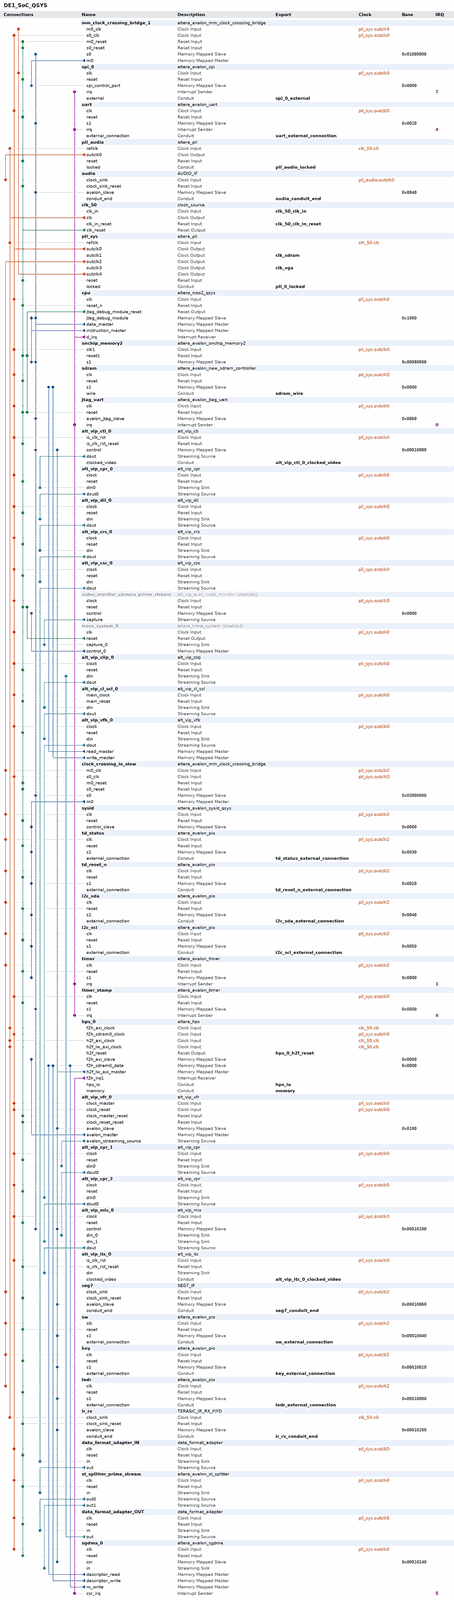
[diagram p0: system contents, whole]
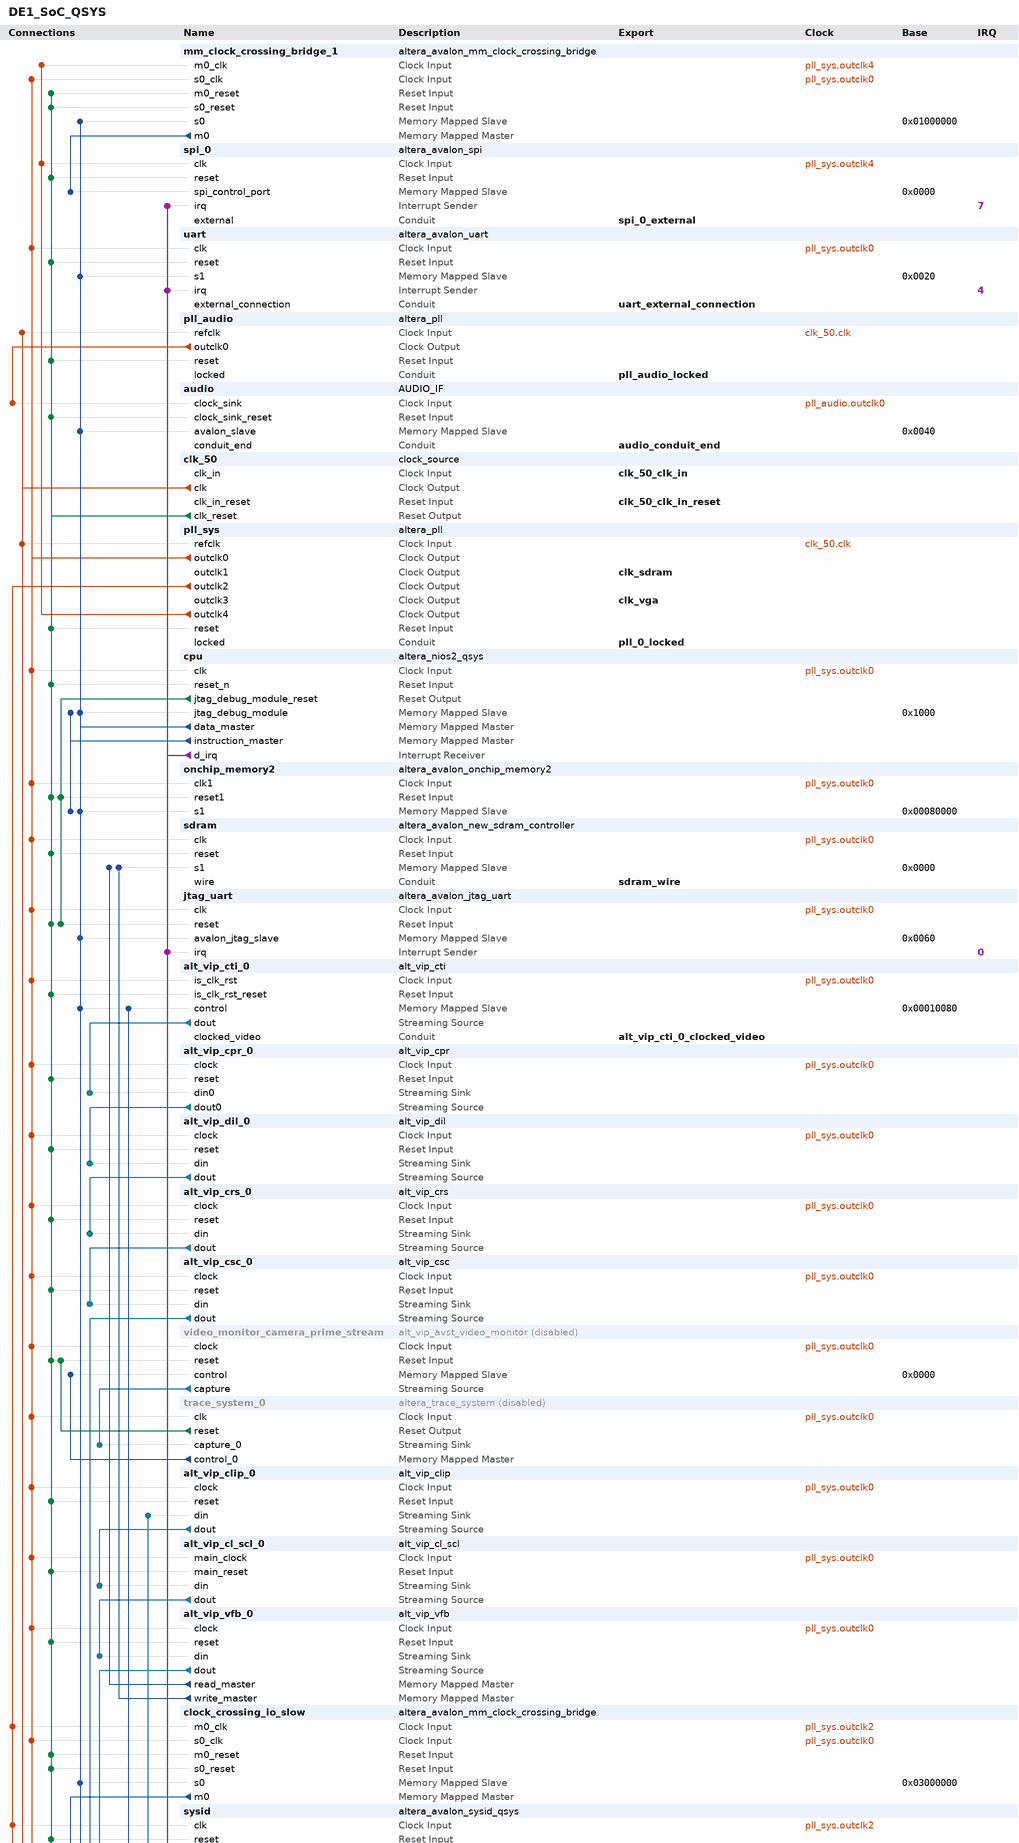
[diagram p1: system contents, upper part]
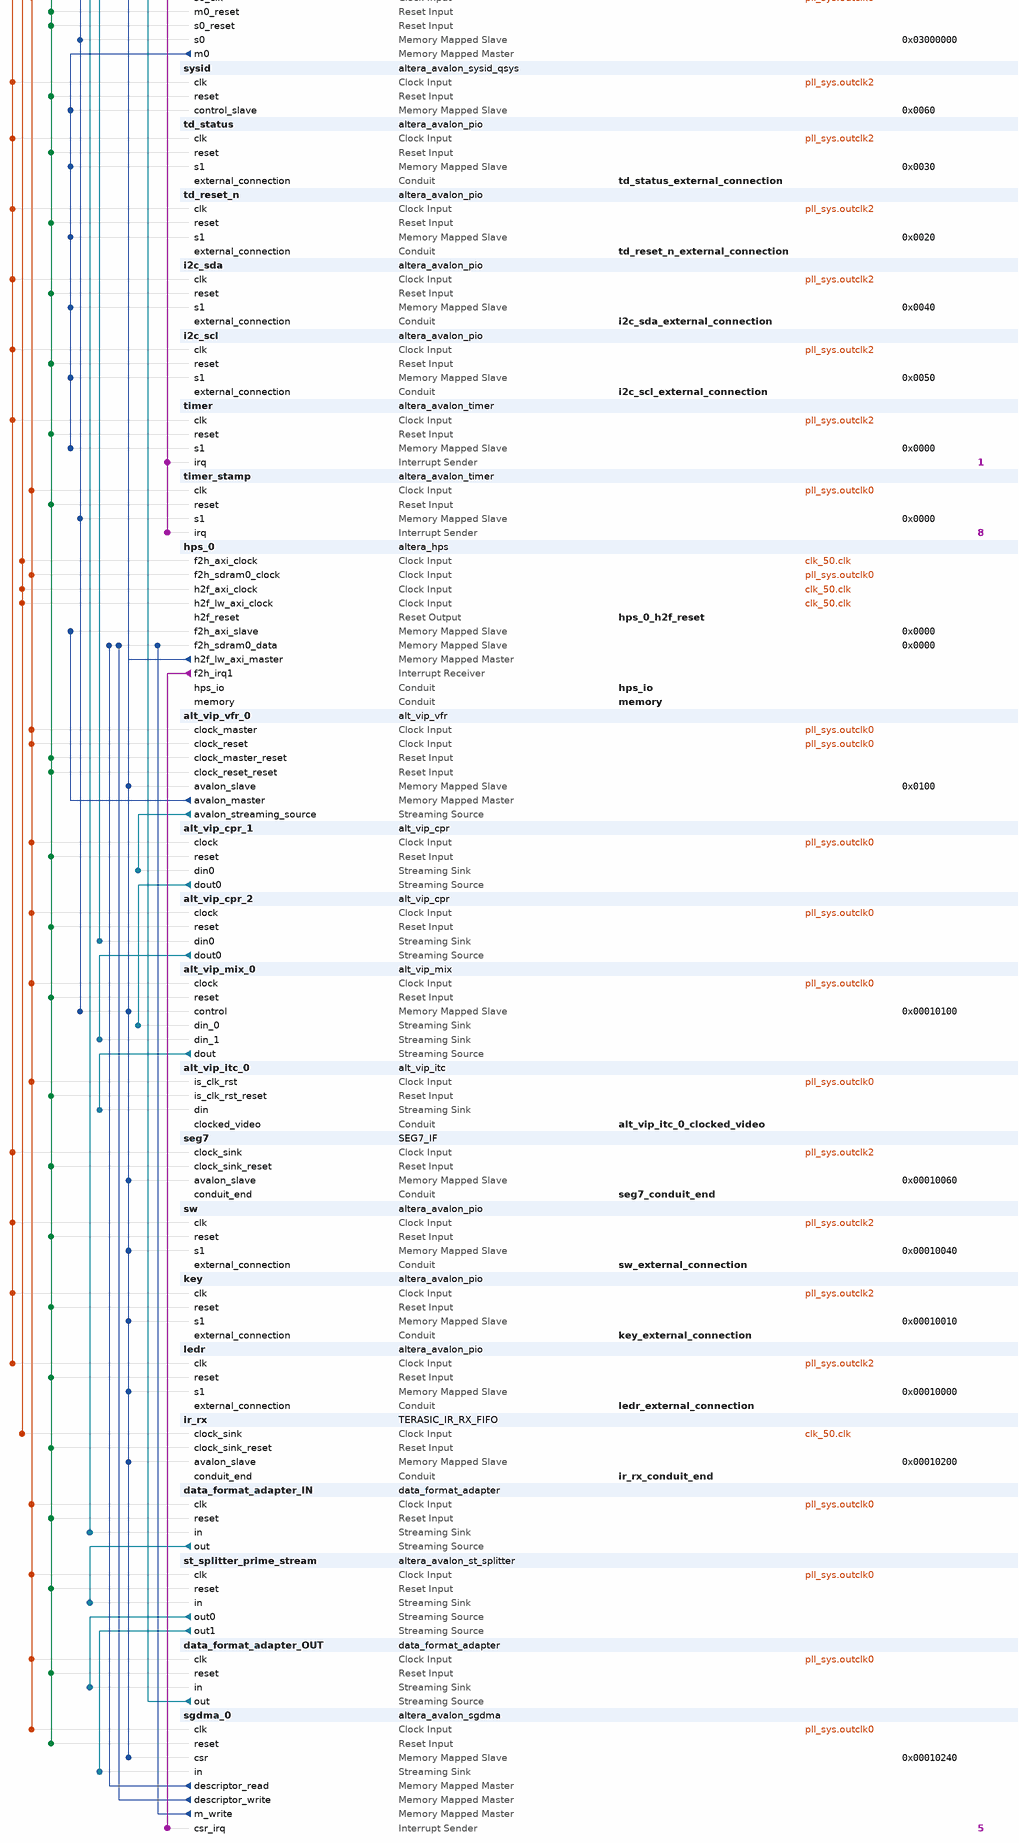
[diagram p2: system contents, lower part]
# Platform Designer (Qsys) system DE1_SoC_QSYS, Cyclone V 5CSEMA5F31C6
# Parameters at their usual value, and those the tool derives, are not listed.
package require -exact qsys 13.1
create_system DE1_SoC_QSYS
set_project_property DEVICE_FAMILY {Cyclone V}
set_project_property DEVICE 5CSEMA5F31C6

add_instance mm_clock_crossing_bridge_1 altera_avalon_mm_clock_crossing_bridge 13.1
set_instance_parameter_value mm_clock_crossing_bridge_1 DATA_WIDTH 32
set_instance_parameter_value mm_clock_crossing_bridge_1 ADDRESS_WIDTH 9
set_instance_parameter_value mm_clock_crossing_bridge_1 MAX_BURST_SIZE 1
set_instance_parameter_value mm_clock_crossing_bridge_1 COMMAND_FIFO_DEPTH 32
set_instance_parameter_value mm_clock_crossing_bridge_1 RESPONSE_FIFO_DEPTH 64
set_instance_parameter_value mm_clock_crossing_bridge_1 MASTER_SYNC_DEPTH 3
set_instance_parameter_value mm_clock_crossing_bridge_1 SLAVE_SYNC_DEPTH 3

add_instance spi_0 altera_avalon_spi 13.1
set_instance_parameter_value spi_0 clockPolarity 1
set_instance_parameter_value spi_0 dataWidth 16
set_instance_parameter_value spi_0 masterSPI true
set_instance_parameter_value spi_0 numberOfSlaves 1
set_instance_parameter_value spi_0 targetClockRate 20000000

add_instance uart altera_avalon_uart 13.1
set_instance_parameter_value uart baud 2400
set_instance_parameter_value uart dataBits 8
set_instance_parameter_value uart fixedBaud false
set_instance_parameter_value uart parity NONE
set_instance_parameter_value uart stopBits 1

add_instance pll_audio altera_pll 13.1
set_instance_parameter_value pll_audio gui_device_speed_grade 2
set_instance_parameter_value pll_audio gui_pll_mode {Fractional-N PLL}
set_instance_parameter_value pll_audio gui_reference_clock_frequency 50.0
set_instance_parameter_value pll_audio gui_operation_mode normal
set_instance_parameter_value pll_audio gui_use_locked true
set_instance_parameter_value pll_audio gui_number_of_clocks 1
set_instance_parameter_value pll_audio gui_output_clock_frequency0 18.432

add_instance audio AUDIO_IF 1.0

add_instance clk_50 clock_source 13.1
set_instance_parameter_value clk_50 clockFrequency 50000000

add_instance pll_sys altera_pll 13.1
set_instance_parameter_value pll_sys gui_device_speed_grade 8
set_instance_parameter_value pll_sys gui_pll_mode {Integer-N PLL}
set_instance_parameter_value pll_sys gui_reference_clock_frequency 50.0
set_instance_parameter_value pll_sys gui_operation_mode normal
set_instance_parameter_value pll_sys gui_use_locked true
set_instance_parameter_value pll_sys gui_number_of_clocks 5
set_instance_parameter_value pll_sys gui_output_clock_frequency0 130.0
set_instance_parameter_value pll_sys gui_output_clock_frequency1 130.0
set_instance_parameter_value pll_sys gui_ps_units1 degrees
set_instance_parameter_value pll_sys gui_phase_shift1 7500
set_instance_parameter_value pll_sys gui_phase_shift_deg1 -90.0
set_instance_parameter_value pll_sys gui_output_clock_frequency2 10.0
set_instance_parameter_value pll_sys gui_output_clock_frequency3 65.0

add_instance cpu altera_nios2_qsys 13.1
set_instance_parameter_value cpu manuallyAssignCpuID false
set_instance_parameter_value cpu resetSlave onchip_memory2.s1
set_instance_parameter_value cpu exceptionSlave onchip_memory2.s1
set_instance_parameter_value cpu breakSlave cpu.jtag_debug_module
set_instance_parameter_value cpu impl Fast
set_instance_parameter_value cpu icache_size 4096

add_instance onchip_memory2 altera_avalon_onchip_memory2 13.1
set_instance_parameter_value onchip_memory2 dataWidth 32
set_instance_parameter_value onchip_memory2 dualPort false
set_instance_parameter_value onchip_memory2 initMemContent true
set_instance_parameter_value onchip_memory2 initializationFileName onchip_memory2
set_instance_parameter_value onchip_memory2 memorySize 160000

add_instance sdram altera_avalon_new_sdram_controller 13.1
set_instance_parameter_value sdram TAC 5.5
set_instance_parameter_value sdram TRCD 20.0
set_instance_parameter_value sdram TRP 20.0
set_instance_parameter_value sdram casLatency 3
set_instance_parameter_value sdram columnWidth 10
set_instance_parameter_value sdram dataWidth 16
set_instance_parameter_value sdram generateSimulationModel true
set_instance_parameter_value sdram model custom
set_instance_parameter_value sdram numberOfBanks 4
set_instance_parameter_value sdram numberOfChipSelects 1
set_instance_parameter_value sdram powerUpDelay 100.0
set_instance_parameter_value sdram refreshPeriod 15.625
set_instance_parameter_value sdram rowWidth 13

add_instance jtag_uart altera_avalon_jtag_uart 13.1
set_instance_parameter_value jtag_uart simInteractiveOptions INTERACTIVE_ASCII_OUTPUT

add_instance alt_vip_cti_0 alt_vip_cti 13.1
set_instance_parameter_value alt_vip_cti_0 FAMILY {Cyclone V}
set_instance_parameter_value alt_vip_cti_0 BPS 8
set_instance_parameter_value alt_vip_cti_0 NUMBER_OF_COLOUR_PLANES 2
set_instance_parameter_value alt_vip_cti_0 COLOUR_PLANES_ARE_IN_PARALLEL 0
set_instance_parameter_value alt_vip_cti_0 SYNC_TO 0
set_instance_parameter_value alt_vip_cti_0 USE_EMBEDDED_SYNCS 1
set_instance_parameter_value alt_vip_cti_0 ADD_DATA_ENABLE_SIGNAL 0
set_instance_parameter_value alt_vip_cti_0 ACCEPT_COLOURS_IN_SEQ 0
set_instance_parameter_value alt_vip_cti_0 USE_STD 0
set_instance_parameter_value alt_vip_cti_0 STD_WIDTH 1
set_instance_parameter_value alt_vip_cti_0 GENERATE_ANC 0
set_instance_parameter_value alt_vip_cti_0 INTERLACED 1
set_instance_parameter_value alt_vip_cti_0 H_ACTIVE_PIXELS_F0 720
set_instance_parameter_value alt_vip_cti_0 V_ACTIVE_LINES_F0 288
set_instance_parameter_value alt_vip_cti_0 V_ACTIVE_LINES_F1 288
set_instance_parameter_value alt_vip_cti_0 FIFO_DEPTH 1440
set_instance_parameter_value alt_vip_cti_0 CLOCKS_ARE_SAME 0
set_instance_parameter_value alt_vip_cti_0 USE_CONTROL 1
set_instance_parameter_value alt_vip_cti_0 GENERATE_SYNC 0

add_instance alt_vip_cpr_0 alt_vip_cpr 13.1
set_instance_parameter_value alt_vip_cpr_0 DIN1_ENABLED 0
set_instance_parameter_value alt_vip_cpr_0 DOUT1_SYMBOLS_PER_BEAT 0
set_instance_parameter_value alt_vip_cpr_0 DOUT0_SYMBOLS_PER_BEAT 2
set_instance_parameter_value alt_vip_cpr_0 DOUT1_ENABLED 0
set_instance_parameter_value alt_vip_cpr_0 PARAMETERISATION {<colourPatternRearrangerParams><CPR_NAME>Color Plane Sequencer</CPR_NAME><CPR_BPS>8</CPR_BPS><CPR_PORTS><INPUT_PORT><NAME>din0</NAME><STREAMING_DESCRIPTOR>[C,Y]</STREAMING_DESCRIPTOR><ENABLED>true</ENABLED></INPUT_PORT><INPUT_PORT><NAME>din1</NAME><STREAMING_DESCRIPTOR>[Channel]</STREAMING_DESCRIPTOR><ENABLED>false</ENABLED></INPUT_PORT><OUTPUT_PORT><NAME>dout0</NAME><STREAMING_DESCRIPTOR>[C:Y]</STREAMING_DESCRIPTOR><ENABLED>true</ENABLED><NON_IMAGE_PACKET_SOURCE>din0</NON_IMAGE_PACKET_SOURCE><HALVE_WIDTH>false</HALVE_WIDTH></OUTPUT_PORT><OUTPUT_PORT><NAME>dout1</NAME><STREAMING_DESCRIPTOR>[Channel]</STREAMING_DESCRIPTOR><ENABLED>false</ENABLED><NON_IMAGE_PACKET_SOURCE>din0</NON_IMAGE_PACKET_SOURCE><HALVE_WIDTH>false</HALVE_WIDTH></OUTPUT_PORT></CPR_PORTS><CPR_INPUT_2_PIXELS>false</CPR_INPUT_2_PIXELS></colourPatternRearrangerParams>}
set_instance_parameter_value alt_vip_cpr_0 DIN0_SYMBOLS_PER_BEAT 1
set_instance_parameter_value alt_vip_cpr_0 DIN1_SYMBOLS_PER_BEAT 0

add_instance alt_vip_dil_0 alt_vip_dil 13.1
set_instance_parameter_value alt_vip_dil_0 READ_MASTERS_REQUIRED 0
set_instance_parameter_value alt_vip_dil_0 WRITE_MASTERS_REQUIRED 0
set_instance_parameter_value alt_vip_dil_0 PARAMETERISATION {<deinterlacerParams><DIL_NAME>my_deinterlacing_core</DIL_NAME><DIL_MAX_WIDTH>720</DIL_MAX_WIDTH><DIL_MAX_HEIGHT>576</DIL_MAX_HEIGHT><DIL_CHANNELS_IN_SEQ>1</DIL_CHANNELS_IN_SEQ><DIL_CHANNELS_IN_PAR>2</DIL_CHANNELS_IN_PAR><DIL_BPS>8</DIL_BPS><DIL_METHOD>DEINTERLACING_BOB_SCANLINE_INTERPOLATION</DIL_METHOD><DIL_FRAMEBUFFERS_ADDR>00</DIL_FRAMEBUFFERS_ADDR><DIL_PRODUCE_FIELDS>DEINTERLACING_F0</DIL_PRODUCE_FIELDS><DIL_BUFFER_AS_THOUGH>DEINTERLACING_NO_BUFFERING</DIL_BUFFER_AS_THOUGH><DIL_DEFAULT_INITIAL_FIELD>FIELD_F0_FIRST</DIL_DEFAULT_INITIAL_FIELD><DIL_MASTER_PORT_WIDTH>64</DIL_MASTER_PORT_WIDTH><DIL_MEM_MASTERS_USE_SEPARATE_CLOCK>0</DIL_MEM_MASTERS_USE_SEPARATE_CLOCK><DIL_EDGE_DEPENDENT_INTERPOLATION>1</DIL_EDGE_DEPENDENT_INTERPOLATION><DIL_MOTION_BLEED>0</DIL_MOTION_BLEED><DIL_RDATA_FIFO_DEPTH>64</DIL_RDATA_FIFO_DEPTH><DIL_RDATA_BURST_TARGET>32</DIL_RDATA_BURST_TARGET><DIL_WDATA_FIFO_DEPTH>64</DIL_WDATA_FIFO_DEPTH><DIL_WDATA_BURST_TARGET>32</DIL_WDATA_BURST_TARGET><DIL_MAX_NUMBER_PACKETS>1</DIL_MAX_NUMBER_PACKETS><DIL_MAX_SYMBOLS_IN_PACKET>10</DIL_MAX_SYMBOLS_IN_PACKET><DIL_MA_RUNTIME_CTRL>0</DIL_MA_RUNTIME_CTRL><DIL_PROPAGATE_PROGRESSIVE>false</DIL_PROPAGATE_PROGRESSIVE><DIL_CONTROLLED_DROP_REPEAT>0</DIL_CONTROLLED_DROP_REPEAT><DIL_MA_422>0</DIL_MA_422><DIL_BURST_ALIGNMENT>0</DIL_BURST_ALIGNMENT></deinterlacerParams>}
set_instance_parameter_value alt_vip_dil_0 MOTION_MASTERS_REQUIRED 0

add_instance alt_vip_crs_0 alt_vip_crs 13.1
set_instance_parameter_value alt_vip_crs_0 OUT_CHANNELS_IN_PAR 3
set_instance_parameter_value alt_vip_crs_0 IN_CHANNELS_IN_PAR 2
set_instance_parameter_value alt_vip_crs_0 PARAMETERISATION {<chromaResamplerParams><CRS_NAME>chroma_resampler</CRS_NAME><CRS_BPS>8</CRS_BPS><CRS_WIDTH>720</CRS_WIDTH><CRS_HEIGHT>576</CRS_HEIGHT><CRS_PARALLEL_MODE>true</CRS_PARALLEL_MODE><CRS_RESAMPLING><FORMAT><IN>422</IN><OUT>444</OUT></FORMAT><COSITING><V>true</V><H>true</H></COSITING></CRS_RESAMPLING><CRS_ALGORITHM><V><NAME>INTERPOLATION_1D_NEAREST_NEIGHBOUR</NAME><LUMA_ADAPTIVE>false</LUMA_ADAPTIVE></V><H><NAME>INTERPOLATION_1D_FULL_FILTERING</NAME><LUMA_ADAPTIVE>false</LUMA_ADAPTIVE></H></CRS_ALGORITHM></chromaResamplerParams>}

add_instance alt_vip_csc_0 alt_vip_csc 13.1
set_instance_parameter_value alt_vip_csc_0 PARAMETERISATION {<cscParams> <CSC_NAME>a_csc</CSC_NAME> <CSC_CHANNELS_IN_SEQ>1</CSC_CHANNELS_IN_SEQ>  <CSC_CHANNELS_IN_PAR>3</CSC_CHANNELS_IN_PAR>  <CSC_INPUT_OUTPUT_DATATYPES>   <IODT_INPUT_BPS>8</IODT_INPUT_BPS>   <IODT_OUTPUT_BPS>8</IODT_OUTPUT_BPS>   <IODT_INPUT_DATA_TYPE>DATA_TYPE_UNSIGNED</IODT_INPUT_DATA_TYPE>   <IODT_OUTPUT_DATA_TYPE>DATA_TYPE_UNSIGNED</IODT_OUTPUT_DATA_TYPE>   <IODT_USE_INPUT_GUARD_BANDS>true</IODT_USE_INPUT_GUARD_BANDS>   <IODT_INPUT_GUARD_MIN>16</IODT_INPUT_GUARD_MIN>   <IODT_INPUT_GUARD_MAX>240</IODT_INPUT_GUARD_MAX>   <IODT_USE_OUTPUT_GUARD_BANDS>false</IODT_USE_OUTPUT_GUARD_BANDS>   <IODT_OUTPUT_GUARD_MIN>0</IODT_OUTPUT_GUARD_MIN>   <IODT_OUTPUT_GUARD_MAX>255</IODT_OUTPUT_GUARD_MAX>  </CSC_INPUT_OUTPUT_DATATYPES>  <CSC_PREDEFINED_CONVERSION>SDTV_YCBCR_TO_CRGB</CSC_PREDEFINED_CONVERSION>  <CSC_COEFFICIENTS><row><mult>2.018</mult><mult>0.0</mult><mult>1.164</mult><add>-276.928</add></row><row><mult>-0.391</mult><mult>-0.813</mult><mult>1.164</mult><add>135.488</add></row><row><mult>0.0</mult><mult>1.596</mult><mult>1.164</mult><add>-222.912</add></row></CSC_COEFFICIENTS>  <CSC_COEFF_PRECISION>   <CPC_INTEGER_BITS>2</CPC_INTEGER_BITS>   <CPC_FRACTION_BITS>8</CPC_FRACTION_BITS>   <CPC_COEFFS_SIGNED>true</CPC_COEFFS_SIGNED>  </CSC_COEFF_PRECISION>  <CSC_SUMM_PRECISION>   <CPC_INTEGER_BITS>9</CPC_INTEGER_BITS>   <CPC_FRACTION_BITS>8</CPC_FRACTION_BITS>   <CPC_COEFFS_SIGNED>true</CPC_COEFFS_SIGNED>  </CSC_SUMM_PRECISION>  <CSC_OUTPUT_CONVERSION>   <ODTC_SCALE>0</ODTC_SCALE>   <ODTC_FIXEDPOINT_TO_INTEGER>FRACTION_BITS_ROUND_HALF_UP</ODTC_FIXEDPOINT_TO_INTEGER>   <ODTC_CONVERT_SIGNED_TO_UNSIGNED>CONVERT_TO_UNSIGNED_SATURATE</ODTC_CONVERT_SIGNED_TO_UNSIGNED>  </CSC_OUTPUT_CONVERSION> <CSC_RUNTIME_COEFFICIENTS>false</CSC_RUNTIME_COEFFICIENTS> </cscParams>}

add_instance video_monitor_camera_prime_stream alt_vip_avst_video_monitor 13.1
set_instance_property video_monitor_camera_prime_stream ENABLED false
set_instance_parameter_value video_monitor_camera_prime_stream BPS 8
set_instance_parameter_value video_monitor_camera_prime_stream CHANNELS_IN_PAR 3
set_instance_parameter_value video_monitor_camera_prime_stream CHANNELS_IN_SEQ 1
set_instance_parameter_value video_monitor_camera_prime_stream BUFFER_DEPTH 256
set_instance_parameter_value video_monitor_camera_prime_stream THUMBNAIL_SUPPORT 1
set_instance_parameter_value video_monitor_camera_prime_stream CAPTURE_SYM_WIDTH 32

add_instance trace_system_0 altera_trace_system 13.1
set_instance_property trace_system_0 ENABLED false
set_instance_parameter_value trace_system_0 MANUAL_DEBUG_FABRIC 1
set_instance_parameter_value trace_system_0 HOST_TYPE JTAG
set_instance_parameter_value trace_system_0 CAPTURE_WIDTH 32
set_instance_parameter_value trace_system_0 INPUTS 2
set_instance_parameter_value trace_system_0 INTERNAL_MEM 1
set_instance_parameter_value trace_system_0 MEMSIZE 32768
set_instance_parameter_value trace_system_0 EXTMEM_BASE 0
set_instance_parameter_value trace_system_0 EXTMEM_SIZE 1048576
set_instance_parameter_value trace_system_0 ENABLE_BETA_EXTERNAL_MEM false
set_instance_parameter_value trace_system_0 CLOCK_RATE 130000000
set_instance_parameter_value trace_system_0 PIPELINE_STAGE_ON_ALL_INPUTS true

add_instance alt_vip_clip_0 alt_vip_clip 13.1
set_instance_parameter_value alt_vip_clip_0 PARAMETERISATION {<clipperParams><CLIP_NAME>clipper</CLIP_NAME><CLIP_BPS>8</CLIP_BPS><CLIP_CHANNELS_IN_SEQ>1</CLIP_CHANNELS_IN_SEQ><CLIP_CHANNELS_IN_PAR>3</CLIP_CHANNELS_IN_PAR><CLIP_WIDTH>720</CLIP_WIDTH><CLIP_HEIGHT>576</CLIP_HEIGHT><CLIP_RUNTIME_CONTROL>false</CLIP_RUNTIME_CONTROL><CLIP_OFFSETS_NOT_RECTANGLE>false</CLIP_OFFSETS_NOT_RECTANGLE><CLIP_LEFT_OFFSET>40</CLIP_LEFT_OFFSET><CLIP_RIGHT_OFFSET>640</CLIP_RIGHT_OFFSET><CLIP_TOP_OFFSET>24</CLIP_TOP_OFFSET><CLIP_BOTTOM_OFFSET>480</CLIP_BOTTOM_OFFSET></clipperParams>}

add_instance alt_vip_cl_scl_0 alt_vip_cl_scl 13.1
set_instance_parameter_value alt_vip_cl_scl_0 FAMILY {Cyclone V}
set_instance_parameter_value alt_vip_cl_scl_0 SYMBOLS_IN_SEQ 1
set_instance_parameter_value alt_vip_cl_scl_0 SYMBOLS_IN_PAR 3
set_instance_parameter_value alt_vip_cl_scl_0 BITS_PER_SYMBOL 8
set_instance_parameter_value alt_vip_cl_scl_0 EXTRA_PIPELINING 0
set_instance_parameter_value alt_vip_cl_scl_0 IS_422 0
set_instance_parameter_value alt_vip_cl_scl_0 NO_BLANKING 1
set_instance_parameter_value alt_vip_cl_scl_0 MAX_IN_WIDTH 640
set_instance_parameter_value alt_vip_cl_scl_0 MAX_IN_HEIGHT 480
set_instance_parameter_value alt_vip_cl_scl_0 MAX_OUT_WIDTH 270
set_instance_parameter_value alt_vip_cl_scl_0 MAX_OUT_HEIGHT 200
set_instance_parameter_value alt_vip_cl_scl_0 RUNTIME_CONTROL 0
set_instance_parameter_value alt_vip_cl_scl_0 ALWAYS_DOWNSCALE 1
set_instance_parameter_value alt_vip_cl_scl_0 ALGORITHM_NAME POLYPHASE
set_instance_parameter_value alt_vip_cl_scl_0 DEFAULT_EDGE_THRESH 7
set_instance_parameter_value alt_vip_cl_scl_0 DEFAULT_UPPER_BLUR 15
set_instance_parameter_value alt_vip_cl_scl_0 DEFAULT_LOWER_BLUR 0
set_instance_parameter_value alt_vip_cl_scl_0 ENABLE_FIR 0
set_instance_parameter_value alt_vip_cl_scl_0 ARE_IDENTICAL 1
set_instance_parameter_value alt_vip_cl_scl_0 V_TAPS 8
set_instance_parameter_value alt_vip_cl_scl_0 V_PHASES 16
set_instance_parameter_value alt_vip_cl_scl_0 H_TAPS 8
set_instance_parameter_value alt_vip_cl_scl_0 H_PHASES 16
set_instance_parameter_value alt_vip_cl_scl_0 V_SIGNED 1
set_instance_parameter_value alt_vip_cl_scl_0 V_INTEGER_BITS 1
set_instance_parameter_value alt_vip_cl_scl_0 V_FRACTION_BITS 7
set_instance_parameter_value alt_vip_cl_scl_0 H_SIGNED 1
set_instance_parameter_value alt_vip_cl_scl_0 H_INTEGER_BITS 1
set_instance_parameter_value alt_vip_cl_scl_0 H_FRACTION_BITS 7
set_instance_parameter_value alt_vip_cl_scl_0 PRESERVE_BITS 0
set_instance_parameter_value alt_vip_cl_scl_0 LOAD_AT_RUNTIME 0
set_instance_parameter_value alt_vip_cl_scl_0 V_BANKS 1
set_instance_parameter_value alt_vip_cl_scl_0 V_SYMMETRIC 0
set_instance_parameter_value alt_vip_cl_scl_0 V_FUNCTION LANCZOS_2
set_instance_parameter_value alt_vip_cl_scl_0 V_COEFF_FILE {<enter file name (including full path)>}
set_instance_parameter_value alt_vip_cl_scl_0 H_BANKS 1
set_instance_parameter_value alt_vip_cl_scl_0 H_SYMMETRIC 0
set_instance_parameter_value alt_vip_cl_scl_0 H_FUNCTION LANCZOS_2
set_instance_parameter_value alt_vip_cl_scl_0 H_COEFF_FILE {<enter file name (including full path)>}
set_instance_parameter_value alt_vip_cl_scl_0 IS_420 0

add_instance alt_vip_vfb_0 alt_vip_vfb 13.1

add_instance clock_crossing_io_slow altera_avalon_mm_clock_crossing_bridge 13.1
set_instance_parameter_value clock_crossing_io_slow DATA_WIDTH 32
set_instance_parameter_value clock_crossing_io_slow ADDRESS_WIDTH 9
set_instance_parameter_value clock_crossing_io_slow MAX_BURST_SIZE 1
set_instance_parameter_value clock_crossing_io_slow COMMAND_FIFO_DEPTH 32
set_instance_parameter_value clock_crossing_io_slow RESPONSE_FIFO_DEPTH 256
set_instance_parameter_value clock_crossing_io_slow MASTER_SYNC_DEPTH 3
set_instance_parameter_value clock_crossing_io_slow SLAVE_SYNC_DEPTH 3

add_instance sysid altera_avalon_sysid_qsys 13.1
set_instance_parameter_value sysid id 0

add_instance td_status altera_avalon_pio 13.1
set_instance_parameter_value td_status direction Input
set_instance_parameter_value td_status width 2

add_instance td_reset_n altera_avalon_pio 13.1
set_instance_parameter_value td_reset_n direction Output
set_instance_parameter_value td_reset_n width 1

add_instance i2c_sda altera_avalon_pio 13.1
set_instance_parameter_value i2c_sda direction Bidir
set_instance_parameter_value i2c_sda width 1

add_instance i2c_scl altera_avalon_pio 13.1
set_instance_parameter_value i2c_scl direction Output
set_instance_parameter_value i2c_scl width 1

add_instance timer altera_avalon_timer 13.1
set_instance_parameter_value timer period 1
set_instance_parameter_value timer periodUnits MSEC

add_instance timer_stamp altera_avalon_timer 13.1
set_instance_parameter_value timer_stamp period 1
set_instance_parameter_value timer_stamp periodUnits MSEC

add_instance hps_0 altera_hps 13.1
set_instance_parameter_value hps_0 MEM_VENDOR JEDEC
set_instance_parameter_value hps_0 MEM_ROW_ADDR_WIDTH 15
set_instance_parameter_value hps_0 MEM_COL_ADDR_WIDTH 10
set_instance_parameter_value hps_0 MEM_DQ_WIDTH 32
set_instance_parameter_value hps_0 MEM_BANKADDR_WIDTH 3
set_instance_parameter_value hps_0 MEM_DRV_STR RZQ/7
set_instance_parameter_value hps_0 MEM_RTT_NOM RZQ/4
set_instance_parameter_value hps_0 MEM_RTT_WR RZQ/4
set_instance_parameter_value hps_0 MEM_WTCL 8
set_instance_parameter_value hps_0 MEM_TCL 11
set_instance_parameter_value hps_0 TIMING_TIS 180
set_instance_parameter_value hps_0 TIMING_TIH 140
set_instance_parameter_value hps_0 TIMING_TDS 30
set_instance_parameter_value hps_0 TIMING_TDH 65
set_instance_parameter_value hps_0 TIMING_TDQSQ 125
set_instance_parameter_value hps_0 TIMING_TDQSCK 255
set_instance_parameter_value hps_0 TIMING_TQSH 0.4
set_instance_parameter_value hps_0 MEM_TRAS_NS 35.0
set_instance_parameter_value hps_0 MEM_TRCD_NS 13.75
set_instance_parameter_value hps_0 MEM_TRP_NS 13.75
set_instance_parameter_value hps_0 MEM_TRFC_NS 260.0
set_instance_parameter_value hps_0 MEM_TFAW_NS 30.0
set_instance_parameter_value hps_0 REF_CLK_FREQ 25.0
set_instance_parameter_value hps_0 DEFAULT_FAST_SIM_MODEL true
set_instance_parameter_value hps_0 TIMING_BOARD_MAX_CK_DELAY 0.03
set_instance_parameter_value hps_0 TIMING_BOARD_MAX_DQS_DELAY 0.02
set_instance_parameter_value hps_0 TIMING_BOARD_SKEW_CKDQS_DIMM_MIN 0.09
set_instance_parameter_value hps_0 TIMING_BOARD_SKEW_CKDQS_DIMM_MAX 0.16
set_instance_parameter_value hps_0 TIMING_BOARD_SKEW_WITHIN_DQS 0.01
set_instance_parameter_value hps_0 TIMING_BOARD_SKEW_BETWEEN_DQS 0.08
set_instance_parameter_value hps_0 TIMING_BOARD_DQ_TO_DQS_SKEW 0.0
set_instance_parameter_value hps_0 TIMING_BOARD_AC_SKEW 0.03
set_instance_parameter_value hps_0 TIMING_BOARD_AC_TO_CK_SKEW 0.0
set_instance_parameter_value hps_0 MEM_CLK_FREQ 400.0
set_instance_parameter_value hps_0 HPS_PROTOCOL DDR3
set_instance_parameter_value hps_0 STM_Enable false
set_instance_parameter_value hps_0 F2S_Width 2
set_instance_parameter_value hps_0 S2F_Width 2
set_instance_parameter_value hps_0 LWH2F_Enable true
set_instance_parameter_value hps_0 F2SDRAM_Type {Avalon-MM Bidirectional}
set_instance_parameter_value hps_0 F2SDRAM_Width 64
set_instance_parameter_value hps_0 F2SCLK_DBGRST_Enable false
set_instance_parameter_value hps_0 F2SCLK_WARMRST_Enable false
set_instance_parameter_value hps_0 F2SCLK_COLDRST_Enable false
set_instance_parameter_value hps_0 F2SINTERRUPT_Enable true
set_instance_parameter_value hps_0 EMAC1_PinMuxing {HPS I/O Set 0}
set_instance_parameter_value hps_0 EMAC1_Mode RGMII
set_instance_parameter_value hps_0 QSPI_PinMuxing {HPS I/O Set 0}
set_instance_parameter_value hps_0 QSPI_Mode {1 SS}
set_instance_parameter_value hps_0 SDIO_PinMuxing {HPS I/O Set 0}
set_instance_parameter_value hps_0 SDIO_Mode {4-bit Data}
set_instance_parameter_value hps_0 USB1_PinMuxing {HPS I/O Set 0}
set_instance_parameter_value hps_0 USB1_Mode SDR
set_instance_parameter_value hps_0 SPIM1_PinMuxing {HPS I/O Set 0}
set_instance_parameter_value hps_0 SPIM1_Mode {Single Slave Select}
set_instance_parameter_value hps_0 UART0_PinMuxing {HPS I/O Set 0}
set_instance_parameter_value hps_0 UART0_Mode {No Flow Control}
set_instance_parameter_value hps_0 I2C0_PinMuxing {HPS I/O Set 0}
set_instance_parameter_value hps_0 I2C0_Mode I2C
set_instance_parameter_value hps_0 I2C1_PinMuxing {HPS I/O Set 0}
set_instance_parameter_value hps_0 I2C1_Mode I2C
set_instance_parameter_value hps_0 S2FCLK_USER1CLK_FREQ 100
set_instance_parameter_value hps_0 FPGA_PERIPHERAL_OUTPUT_CLOCK_FREQ_EMAC0_MD_CLK 100
set_instance_parameter_value hps_0 FPGA_PERIPHERAL_OUTPUT_CLOCK_FREQ_EMAC0_GTX_CLK 100
set_instance_parameter_value hps_0 FPGA_PERIPHERAL_OUTPUT_CLOCK_FREQ_EMAC1_MD_CLK 100
set_instance_parameter_value hps_0 FPGA_PERIPHERAL_OUTPUT_CLOCK_FREQ_EMAC1_GTX_CLK 100

add_instance alt_vip_vfr_0 alt_vip_vfr 13.1
set_instance_parameter_value alt_vip_vfr_0 MAX_IMAGE_WIDTH 1024

add_instance alt_vip_cpr_1 alt_vip_cpr 13.1
set_instance_parameter_value alt_vip_cpr_1 DIN1_ENABLED 0
set_instance_parameter_value alt_vip_cpr_1 DOUT1_SYMBOLS_PER_BEAT 0
set_instance_parameter_value alt_vip_cpr_1 DOUT0_SYMBOLS_PER_BEAT 3
set_instance_parameter_value alt_vip_cpr_1 DOUT1_ENABLED 0
set_instance_parameter_value alt_vip_cpr_1 PARAMETERISATION {<colourPatternRearrangerParams><CPR_NAME>Color Plane Sequencer</CPR_NAME><CPR_BPS>8</CPR_BPS><CPR_PORTS><INPUT_PORT><NAME>din0</NAME><STREAMING_DESCRIPTOR>[B:G:R:unnamed]</STREAMING_DESCRIPTOR><ENABLED>true</ENABLED></INPUT_PORT><INPUT_PORT><NAME>din1</NAME><STREAMING_DESCRIPTOR>[Channel]</STREAMING_DESCRIPTOR><ENABLED>false</ENABLED></INPUT_PORT><OUTPUT_PORT><NAME>dout0</NAME><STREAMING_DESCRIPTOR>[B:G:R]</STREAMING_DESCRIPTOR><ENABLED>true</ENABLED><NON_IMAGE_PACKET_SOURCE>din0</NON_IMAGE_PACKET_SOURCE><HALVE_WIDTH>false</HALVE_WIDTH></OUTPUT_PORT><OUTPUT_PORT><NAME>dout1</NAME><STREAMING_DESCRIPTOR>[Channel]</STREAMING_DESCRIPTOR><ENABLED>false</ENABLED><NON_IMAGE_PACKET_SOURCE>din0</NON_IMAGE_PACKET_SOURCE><HALVE_WIDTH>false</HALVE_WIDTH></OUTPUT_PORT></CPR_PORTS><CPR_INPUT_2_PIXELS>false</CPR_INPUT_2_PIXELS></colourPatternRearrangerParams>}
set_instance_parameter_value alt_vip_cpr_1 DIN0_SYMBOLS_PER_BEAT 4
set_instance_parameter_value alt_vip_cpr_1 DIN1_SYMBOLS_PER_BEAT 0

add_instance alt_vip_cpr_2 alt_vip_cpr 13.1
set_instance_parameter_value alt_vip_cpr_2 DIN1_ENABLED 0
set_instance_parameter_value alt_vip_cpr_2 DOUT1_SYMBOLS_PER_BEAT 0
set_instance_parameter_value alt_vip_cpr_2 DOUT0_SYMBOLS_PER_BEAT 3
set_instance_parameter_value alt_vip_cpr_2 DOUT1_ENABLED 0
set_instance_parameter_value alt_vip_cpr_2 PARAMETERISATION {<colourPatternRearrangerParams><CPR_NAME>Color Plane Sequencer</CPR_NAME><CPR_BPS>8</CPR_BPS><CPR_PORTS><INPUT_PORT><NAME>din0</NAME><STREAMING_DESCRIPTOR>[R:G:B]</STREAMING_DESCRIPTOR><ENABLED>true</ENABLED></INPUT_PORT><INPUT_PORT><NAME>din1</NAME><STREAMING_DESCRIPTOR>[Channel]</STREAMING_DESCRIPTOR><ENABLED>false</ENABLED></INPUT_PORT><OUTPUT_PORT><NAME>dout0</NAME><STREAMING_DESCRIPTOR>[B:G:R]</STREAMING_DESCRIPTOR><ENABLED>true</ENABLED><NON_IMAGE_PACKET_SOURCE>din0</NON_IMAGE_PACKET_SOURCE><HALVE_WIDTH>false</HALVE_WIDTH></OUTPUT_PORT><OUTPUT_PORT><NAME>dout1</NAME><STREAMING_DESCRIPTOR>[Channel]</STREAMING_DESCRIPTOR><ENABLED>false</ENABLED><NON_IMAGE_PACKET_SOURCE>din0</NON_IMAGE_PACKET_SOURCE><HALVE_WIDTH>false</HALVE_WIDTH></OUTPUT_PORT></CPR_PORTS><CPR_INPUT_2_PIXELS>false</CPR_INPUT_2_PIXELS></colourPatternRearrangerParams>}
set_instance_parameter_value alt_vip_cpr_2 DIN0_SYMBOLS_PER_BEAT 3
set_instance_parameter_value alt_vip_cpr_2 DIN1_SYMBOLS_PER_BEAT 0

add_instance alt_vip_mix_0 alt_vip_mix 13.1
set_instance_parameter_value alt_vip_mix_0 PARAMETERISATION {<mixerParams><MIX_NAME>mixer</MIX_NAME><MIX_ALPHA_ENABLED>false</MIX_ALPHA_ENABLED><MIX_ALPHA_BPS>8</MIX_ALPHA_BPS><MIX_CHANNELS_IN_SEQ>1</MIX_CHANNELS_IN_SEQ><MIX_CHANNELS_IN_PAR>3</MIX_CHANNELS_IN_PAR><MIX_BPS>8</MIX_BPS><MIX_NUM_LAYERS>2</MIX_NUM_LAYERS><MIX_RUNTIME_MAX_WIDTH>1024</MIX_RUNTIME_MAX_WIDTH><MIX_RUNTIME_MAX_HEIGHT>768</MIX_RUNTIME_MAX_HEIGHT></mixerParams>}

add_instance alt_vip_itc_0 alt_vip_itc 13.1
set_instance_parameter_value alt_vip_itc_0 NUMBER_OF_COLOUR_PLANES 3
set_instance_parameter_value alt_vip_itc_0 H_ACTIVE_PIXELS 1024
set_instance_parameter_value alt_vip_itc_0 V_ACTIVE_LINES 768
set_instance_parameter_value alt_vip_itc_0 FIFO_DEPTH 10240
set_instance_parameter_value alt_vip_itc_0 THRESHOLD 10239
set_instance_parameter_value alt_vip_itc_0 H_SYNC_LENGTH 136
set_instance_parameter_value alt_vip_itc_0 H_FRONT_PORCH 24
set_instance_parameter_value alt_vip_itc_0 H_BACK_PORCH 160
set_instance_parameter_value alt_vip_itc_0 V_SYNC_LENGTH 6
set_instance_parameter_value alt_vip_itc_0 V_FRONT_PORCH 3
set_instance_parameter_value alt_vip_itc_0 V_BACK_PORCH 29

add_instance seg7 SEG7_IF 1.0
set_instance_parameter_value seg7 SEG7_NUM 6

add_instance sw altera_avalon_pio 13.1
set_instance_parameter_value sw captureEdge true
set_instance_parameter_value sw direction Input
set_instance_parameter_value sw edgeType ANY
set_instance_parameter_value sw generateIRQ true
set_instance_parameter_value sw irqType EDGE
set_instance_parameter_value sw width 10

add_instance key altera_avalon_pio 13.1
set_instance_parameter_value key captureEdge true
set_instance_parameter_value key direction Input
set_instance_parameter_value key edgeType ANY
set_instance_parameter_value key generateIRQ true
set_instance_parameter_value key irqType EDGE
set_instance_parameter_value key width 4

add_instance ledr altera_avalon_pio 13.1
set_instance_parameter_value ledr direction Output
set_instance_parameter_value ledr width 10

add_instance ir_rx TERASIC_IR_RX_FIFO 1.0

add_instance data_format_adapter_IN data_format_adapter 13.1
set_instance_parameter_value data_format_adapter_IN generationLanguage VERILOG
set_instance_parameter_value data_format_adapter_IN inBitsPerSymbol 8
set_instance_parameter_value data_format_adapter_IN inChannelWidth 0
set_instance_parameter_value data_format_adapter_IN inErrorWidth 0
set_instance_parameter_value data_format_adapter_IN inMaxChannel 0
set_instance_parameter_value data_format_adapter_IN inReadyLatency 1
set_instance_parameter_value data_format_adapter_IN inSymbolsPerBeat 3
set_instance_parameter_value data_format_adapter_IN inUseEmpty false
set_instance_parameter_value data_format_adapter_IN inUseEmptyPort NO
set_instance_parameter_value data_format_adapter_IN inUsePackets true
set_instance_parameter_value data_format_adapter_IN inUseReady true
set_instance_parameter_value data_format_adapter_IN outSymbolsPerBeat 3
set_instance_parameter_value data_format_adapter_IN outUseEmpty false
set_instance_parameter_value data_format_adapter_IN outUseEmptyPort YES

add_instance st_splitter_prime_stream altera_avalon_st_splitter 13.1
set_instance_parameter_value st_splitter_prime_stream NUMBER_OF_OUTPUTS 2
set_instance_parameter_value st_splitter_prime_stream QUALIFY_VALID_OUT 1
set_instance_parameter_value st_splitter_prime_stream USE_READY 1
set_instance_parameter_value st_splitter_prime_stream USE_VALID 1
set_instance_parameter_value st_splitter_prime_stream USE_PACKETS 1
set_instance_parameter_value st_splitter_prime_stream USE_CHANNEL 0
set_instance_parameter_value st_splitter_prime_stream USE_ERROR 1
set_instance_parameter_value st_splitter_prime_stream USE_DATA 1
set_instance_parameter_value st_splitter_prime_stream DATA_WIDTH 32
set_instance_parameter_value st_splitter_prime_stream CHANNEL_WIDTH 1
set_instance_parameter_value st_splitter_prime_stream ERROR_WIDTH 1
set_instance_parameter_value st_splitter_prime_stream BITS_PER_SYMBOL 8
set_instance_parameter_value st_splitter_prime_stream MAX_CHANNELS 1
set_instance_parameter_value st_splitter_prime_stream READY_LATENCY 0

add_instance data_format_adapter_OUT data_format_adapter 13.1
set_instance_parameter_value data_format_adapter_OUT generationLanguage VERILOG
set_instance_parameter_value data_format_adapter_OUT inBitsPerSymbol 8
set_instance_parameter_value data_format_adapter_OUT inChannelWidth 0
set_instance_parameter_value data_format_adapter_OUT inErrorWidth 0
set_instance_parameter_value data_format_adapter_OUT inMaxChannel 0
set_instance_parameter_value data_format_adapter_OUT inReadyLatency 1
set_instance_parameter_value data_format_adapter_OUT inSymbolsPerBeat 3
set_instance_parameter_value data_format_adapter_OUT inUseEmpty false
set_instance_parameter_value data_format_adapter_OUT inUseEmptyPort YES
set_instance_parameter_value data_format_adapter_OUT inUsePackets true
set_instance_parameter_value data_format_adapter_OUT inUseReady true
set_instance_parameter_value data_format_adapter_OUT outSymbolsPerBeat 3
set_instance_parameter_value data_format_adapter_OUT outUseEmpty false
set_instance_parameter_value data_format_adapter_OUT outUseEmptyPort NO

add_instance sgdma_0 altera_avalon_sgdma 13.1
set_instance_parameter_value sgdma_0 enableBurstTransfers false
set_instance_parameter_value sgdma_0 enableUnalignedTransfers false
set_instance_parameter_value sgdma_0 readBlockDataWidth 32
set_instance_parameter_value sgdma_0 sinkErrorWidth 0
set_instance_parameter_value sgdma_0 sourceErrorWidth 0
set_instance_parameter_value sgdma_0 transferMode STREAM_TO_MEMORY
set_instance_parameter_value sgdma_0 writeBurstcountWidth 4

# connections
add_connection clk_50.clk hps_0.f2h_axi_clock clock
add_connection clk_50.clk hps_0.h2f_axi_clock clock
add_connection clk_50.clk hps_0.h2f_lw_axi_clock clock
add_connection clk_50.clk ir_rx.clock_sink clock
add_connection clk_50.clk pll_audio.refclk clock
add_connection clk_50.clk pll_sys.refclk clock
add_connection pll_audio.outclk0 audio.clock_sink clock
add_connection pll_sys.outclk0 alt_vip_cl_scl_0.main_clock clock
add_connection pll_sys.outclk0 alt_vip_clip_0.clock clock
add_connection pll_sys.outclk0 alt_vip_cpr_0.clock clock
add_connection pll_sys.outclk0 alt_vip_cpr_1.clock clock
add_connection pll_sys.outclk0 alt_vip_cpr_2.clock clock
add_connection pll_sys.outclk0 alt_vip_crs_0.clock clock
add_connection pll_sys.outclk0 alt_vip_csc_0.clock clock
add_connection pll_sys.outclk0 alt_vip_cti_0.is_clk_rst clock
add_connection pll_sys.outclk0 alt_vip_dil_0.clock clock
add_connection pll_sys.outclk0 alt_vip_itc_0.is_clk_rst clock
add_connection pll_sys.outclk0 alt_vip_mix_0.clock clock
add_connection pll_sys.outclk0 alt_vip_vfb_0.clock clock
add_connection pll_sys.outclk0 alt_vip_vfr_0.clock_master clock
add_connection pll_sys.outclk0 alt_vip_vfr_0.clock_reset clock
add_connection pll_sys.outclk0 clock_crossing_io_slow.s0_clk clock
add_connection pll_sys.outclk0 cpu.clk clock
add_connection pll_sys.outclk0 data_format_adapter_IN.clk clock
add_connection pll_sys.outclk0 data_format_adapter_OUT.clk clock
add_connection pll_sys.outclk0 hps_0.f2h_sdram0_clock clock
add_connection pll_sys.outclk0 jtag_uart.clk clock
add_connection pll_sys.outclk0 mm_clock_crossing_bridge_1.s0_clk clock
add_connection pll_sys.outclk0 onchip_memory2.clk1 clock
add_connection pll_sys.outclk0 sdram.clk clock
add_connection pll_sys.outclk0 sgdma_0.clk clock
add_connection pll_sys.outclk0 st_splitter_prime_stream.clk clock
add_connection pll_sys.outclk0 timer_stamp.clk clock
add_connection pll_sys.outclk0 trace_system_0.clk clock
add_connection pll_sys.outclk0 uart.clk clock
add_connection pll_sys.outclk0 video_monitor_camera_prime_stream.clock clock
add_connection pll_sys.outclk2 clock_crossing_io_slow.m0_clk clock
add_connection pll_sys.outclk2 i2c_scl.clk clock
add_connection pll_sys.outclk2 i2c_sda.clk clock
add_connection pll_sys.outclk2 key.clk clock
add_connection pll_sys.outclk2 ledr.clk clock
add_connection pll_sys.outclk2 seg7.clock_sink clock
add_connection pll_sys.outclk2 sw.clk clock
add_connection pll_sys.outclk2 sysid.clk clock
add_connection pll_sys.outclk2 td_reset_n.clk clock
add_connection pll_sys.outclk2 td_status.clk clock
add_connection pll_sys.outclk2 timer.clk clock
add_connection pll_sys.outclk4 mm_clock_crossing_bridge_1.m0_clk clock
add_connection pll_sys.outclk4 spi_0.clk clock
add_connection clk_50.clk_reset alt_vip_cl_scl_0.main_reset reset
add_connection clk_50.clk_reset alt_vip_clip_0.reset reset
add_connection clk_50.clk_reset alt_vip_cpr_0.reset reset
add_connection clk_50.clk_reset alt_vip_cpr_1.reset reset
add_connection clk_50.clk_reset alt_vip_cpr_2.reset reset
add_connection clk_50.clk_reset alt_vip_crs_0.reset reset
add_connection clk_50.clk_reset alt_vip_csc_0.reset reset
add_connection clk_50.clk_reset alt_vip_cti_0.is_clk_rst_reset reset
add_connection clk_50.clk_reset alt_vip_dil_0.reset reset
add_connection clk_50.clk_reset alt_vip_itc_0.is_clk_rst_reset reset
add_connection clk_50.clk_reset alt_vip_mix_0.reset reset
add_connection clk_50.clk_reset alt_vip_vfb_0.reset reset
add_connection clk_50.clk_reset alt_vip_vfr_0.clock_master_reset reset
add_connection clk_50.clk_reset alt_vip_vfr_0.clock_reset_reset reset
add_connection clk_50.clk_reset audio.clock_sink_reset reset
add_connection clk_50.clk_reset clock_crossing_io_slow.m0_reset reset
add_connection clk_50.clk_reset clock_crossing_io_slow.s0_reset reset
add_connection clk_50.clk_reset cpu.reset_n reset
add_connection clk_50.clk_reset data_format_adapter_IN.reset reset
add_connection clk_50.clk_reset data_format_adapter_OUT.reset reset
add_connection clk_50.clk_reset i2c_scl.reset reset
add_connection clk_50.clk_reset i2c_sda.reset reset
add_connection clk_50.clk_reset ir_rx.clock_sink_reset reset
add_connection clk_50.clk_reset jtag_uart.reset reset
add_connection clk_50.clk_reset key.reset reset
add_connection clk_50.clk_reset ledr.reset reset
add_connection clk_50.clk_reset mm_clock_crossing_bridge_1.m0_reset reset
add_connection clk_50.clk_reset mm_clock_crossing_bridge_1.s0_reset reset
add_connection clk_50.clk_reset onchip_memory2.reset1 reset
add_connection clk_50.clk_reset pll_audio.reset reset
add_connection clk_50.clk_reset pll_sys.reset reset
add_connection clk_50.clk_reset sdram.reset reset
add_connection clk_50.clk_reset seg7.clock_sink_reset reset
add_connection clk_50.clk_reset sgdma_0.reset reset
add_connection clk_50.clk_reset spi_0.reset reset
add_connection clk_50.clk_reset st_splitter_prime_stream.reset reset
add_connection clk_50.clk_reset sw.reset reset
add_connection clk_50.clk_reset sysid.reset reset
add_connection clk_50.clk_reset td_reset_n.reset reset
add_connection clk_50.clk_reset td_status.reset reset
add_connection clk_50.clk_reset timer.reset reset
add_connection clk_50.clk_reset timer_stamp.reset reset
add_connection clk_50.clk_reset uart.reset reset
add_connection clk_50.clk_reset video_monitor_camera_prime_stream.reset reset
add_connection cpu.jtag_debug_module_reset jtag_uart.reset reset
add_connection cpu.jtag_debug_module_reset onchip_memory2.reset1 reset
add_connection trace_system_0.reset video_monitor_camera_prime_stream.reset reset
add_connection alt_vip_vfb_0.read_master sdram.s1 avalon
set_connection_parameter_value alt_vip_vfb_0.read_master/sdram.s1 baseAddress 0x0000
add_connection alt_vip_vfb_0.write_master sdram.s1 avalon
set_connection_parameter_value alt_vip_vfb_0.write_master/sdram.s1 baseAddress 0x0000
add_connection alt_vip_vfr_0.avalon_master hps_0.f2h_axi_slave avalon
set_connection_parameter_value alt_vip_vfr_0.avalon_master/hps_0.f2h_axi_slave baseAddress 0x0000
add_connection clock_crossing_io_slow.m0 i2c_scl.s1 avalon
set_connection_parameter_value clock_crossing_io_slow.m0/i2c_scl.s1 baseAddress 0x0050
add_connection clock_crossing_io_slow.m0 i2c_sda.s1 avalon
set_connection_parameter_value clock_crossing_io_slow.m0/i2c_sda.s1 baseAddress 0x0040
add_connection clock_crossing_io_slow.m0 sysid.control_slave avalon
set_connection_parameter_value clock_crossing_io_slow.m0/sysid.control_slave baseAddress 0x0060
add_connection clock_crossing_io_slow.m0 td_reset_n.s1 avalon
set_connection_parameter_value clock_crossing_io_slow.m0/td_reset_n.s1 baseAddress 0x0020
add_connection clock_crossing_io_slow.m0 td_status.s1 avalon
set_connection_parameter_value clock_crossing_io_slow.m0/td_status.s1 baseAddress 0x0030
add_connection clock_crossing_io_slow.m0 timer.s1 avalon
set_connection_parameter_value clock_crossing_io_slow.m0/timer.s1 baseAddress 0x0000
add_connection cpu.data_master alt_vip_cti_0.control avalon
set_connection_parameter_value cpu.data_master/alt_vip_cti_0.control baseAddress 0x00010080
add_connection cpu.data_master alt_vip_mix_0.control avalon
set_connection_parameter_value cpu.data_master/alt_vip_mix_0.control baseAddress 0x00010100
add_connection cpu.data_master audio.avalon_slave avalon
set_connection_parameter_value cpu.data_master/audio.avalon_slave baseAddress 0x0040
add_connection cpu.data_master clock_crossing_io_slow.s0 avalon
set_connection_parameter_value cpu.data_master/clock_crossing_io_slow.s0 baseAddress 0x03000000
add_connection cpu.data_master cpu.jtag_debug_module avalon
set_connection_parameter_value cpu.data_master/cpu.jtag_debug_module baseAddress 0x1000
add_connection cpu.data_master jtag_uart.avalon_jtag_slave avalon
set_connection_parameter_value cpu.data_master/jtag_uart.avalon_jtag_slave baseAddress 0x0060
add_connection cpu.data_master mm_clock_crossing_bridge_1.s0 avalon
set_connection_parameter_value cpu.data_master/mm_clock_crossing_bridge_1.s0 baseAddress 0x01000000
add_connection cpu.data_master onchip_memory2.s1 avalon
set_connection_parameter_value cpu.data_master/onchip_memory2.s1 baseAddress 0x00080000
add_connection cpu.data_master timer_stamp.s1 avalon
set_connection_parameter_value cpu.data_master/timer_stamp.s1 baseAddress 0x0000
add_connection cpu.data_master uart.s1 avalon
set_connection_parameter_value cpu.data_master/uart.s1 baseAddress 0x0020
add_connection cpu.instruction_master cpu.jtag_debug_module avalon
set_connection_parameter_value cpu.instruction_master/cpu.jtag_debug_module baseAddress 0x1000
add_connection cpu.instruction_master onchip_memory2.s1 avalon
set_connection_parameter_value cpu.instruction_master/onchip_memory2.s1 baseAddress 0x00080000
add_connection hps_0.h2f_lw_axi_master alt_vip_cti_0.control avalon
set_connection_parameter_value hps_0.h2f_lw_axi_master/alt_vip_cti_0.control baseAddress 0x00010080
add_connection hps_0.h2f_lw_axi_master alt_vip_mix_0.control avalon
set_connection_parameter_value hps_0.h2f_lw_axi_master/alt_vip_mix_0.control baseAddress 0x00010100
add_connection hps_0.h2f_lw_axi_master alt_vip_vfr_0.avalon_slave avalon
set_connection_parameter_value hps_0.h2f_lw_axi_master/alt_vip_vfr_0.avalon_slave baseAddress 0x0100
add_connection hps_0.h2f_lw_axi_master ir_rx.avalon_slave avalon
set_connection_parameter_value hps_0.h2f_lw_axi_master/ir_rx.avalon_slave baseAddress 0x00010200
add_connection hps_0.h2f_lw_axi_master key.s1 avalon
set_connection_parameter_value hps_0.h2f_lw_axi_master/key.s1 baseAddress 0x00010010
add_connection hps_0.h2f_lw_axi_master ledr.s1 avalon
set_connection_parameter_value hps_0.h2f_lw_axi_master/ledr.s1 baseAddress 0x00010000
add_connection hps_0.h2f_lw_axi_master seg7.avalon_slave avalon
set_connection_parameter_value hps_0.h2f_lw_axi_master/seg7.avalon_slave baseAddress 0x00010060
add_connection hps_0.h2f_lw_axi_master sgdma_0.csr avalon
set_connection_parameter_value hps_0.h2f_lw_axi_master/sgdma_0.csr baseAddress 0x00010240
add_connection hps_0.h2f_lw_axi_master sw.s1 avalon
set_connection_parameter_value hps_0.h2f_lw_axi_master/sw.s1 baseAddress 0x00010040
add_connection mm_clock_crossing_bridge_1.m0 spi_0.spi_control_port avalon
set_connection_parameter_value mm_clock_crossing_bridge_1.m0/spi_0.spi_control_port baseAddress 0x0000
add_connection sgdma_0.descriptor_read hps_0.f2h_sdram0_data avalon
set_connection_parameter_value sgdma_0.descriptor_read/hps_0.f2h_sdram0_data baseAddress 0x0000
add_connection sgdma_0.descriptor_write hps_0.f2h_sdram0_data avalon
set_connection_parameter_value sgdma_0.descriptor_write/hps_0.f2h_sdram0_data baseAddress 0x0000
add_connection sgdma_0.m_write hps_0.f2h_sdram0_data avalon
set_connection_parameter_value sgdma_0.m_write/hps_0.f2h_sdram0_data baseAddress 0x0000
add_connection trace_system_0.control_0 video_monitor_camera_prime_stream.control avalon
set_connection_parameter_value trace_system_0.control_0/video_monitor_camera_prime_stream.control baseAddress 0x0000
add_connection alt_vip_cl_scl_0.dout alt_vip_vfb_0.din avalon_streaming
add_connection alt_vip_clip_0.dout alt_vip_cl_scl_0.din avalon_streaming
add_connection alt_vip_cpr_0.dout0 alt_vip_dil_0.din avalon_streaming
add_connection alt_vip_cpr_1.dout0 alt_vip_mix_0.din_0 avalon_streaming
add_connection alt_vip_cpr_2.dout0 alt_vip_mix_0.din_1 avalon_streaming
add_connection alt_vip_crs_0.dout alt_vip_csc_0.din avalon_streaming
add_connection alt_vip_csc_0.dout data_format_adapter_IN.in avalon_streaming
add_connection alt_vip_cti_0.dout alt_vip_cpr_0.din0 avalon_streaming
add_connection alt_vip_dil_0.dout alt_vip_crs_0.din avalon_streaming
add_connection alt_vip_mix_0.dout alt_vip_itc_0.din avalon_streaming
add_connection alt_vip_vfb_0.dout alt_vip_cpr_2.din0 avalon_streaming
add_connection alt_vip_vfr_0.avalon_streaming_source alt_vip_cpr_1.din0 avalon_streaming
add_connection data_format_adapter_IN.out st_splitter_prime_stream.in avalon_streaming
add_connection data_format_adapter_OUT.out alt_vip_clip_0.din avalon_streaming
add_connection st_splitter_prime_stream.out0 data_format_adapter_OUT.in avalon_streaming
add_connection st_splitter_prime_stream.out1 sgdma_0.in avalon_streaming
add_connection video_monitor_camera_prime_stream.capture trace_system_0.capture_0 avalon_streaming
add_connection cpu.d_irq jtag_uart.irq interrupt
set_connection_parameter_value cpu.d_irq/jtag_uart.irq irqNumber 0
add_connection cpu.d_irq spi_0.irq interrupt
set_connection_parameter_value cpu.d_irq/spi_0.irq irqNumber 7
add_connection cpu.d_irq timer.irq interrupt
set_connection_parameter_value cpu.d_irq/timer.irq irqNumber 1
add_connection cpu.d_irq timer_stamp.irq interrupt
set_connection_parameter_value cpu.d_irq/timer_stamp.irq irqNumber 8
add_connection cpu.d_irq uart.irq interrupt
set_connection_parameter_value cpu.d_irq/uart.irq irqNumber 4
add_connection hps_0.f2h_irq1 sgdma_0.csr_irq interrupt
set_connection_parameter_value hps_0.f2h_irq1/sgdma_0.csr_irq irqNumber 5

# exported interfaces
add_interface i2c_scl_external_connection conduit end
set_interface_property i2c_scl_external_connection EXPORT_OF i2c_scl.external_connection
add_interface i2c_sda_external_connection conduit end
set_interface_property i2c_sda_external_connection EXPORT_OF i2c_sda.external_connection
add_interface td_reset_n_external_connection conduit end
set_interface_property td_reset_n_external_connection EXPORT_OF td_reset_n.external_connection
add_interface clk_50_clk_in clock sink
set_interface_property clk_50_clk_in EXPORT_OF clk_50.clk_in
add_interface td_status_external_connection conduit end
set_interface_property td_status_external_connection EXPORT_OF td_status.external_connection
add_interface clk_50_clk_in_reset reset sink
set_interface_property clk_50_clk_in_reset EXPORT_OF clk_50.clk_in_reset
add_interface alt_vip_cti_0_clocked_video conduit end
set_interface_property alt_vip_cti_0_clocked_video EXPORT_OF alt_vip_cti_0.clocked_video
add_interface sdram_wire conduit end
set_interface_property sdram_wire EXPORT_OF sdram.wire
add_interface pll_0_locked conduit end
set_interface_property pll_0_locked EXPORT_OF pll_sys.locked
add_interface clk_sdram clock source
set_interface_property clk_sdram EXPORT_OF pll_sys.outclk1
add_interface clk_vga clock source
set_interface_property clk_vga EXPORT_OF pll_sys.outclk3
add_interface seg7_conduit_end conduit end
set_interface_property seg7_conduit_end EXPORT_OF seg7.conduit_end
add_interface ledr_external_connection conduit end
set_interface_property ledr_external_connection EXPORT_OF ledr.external_connection
add_interface key_external_connection conduit end
set_interface_property key_external_connection EXPORT_OF key.external_connection
add_interface sw_external_connection conduit end
set_interface_property sw_external_connection EXPORT_OF sw.external_connection
add_interface spi_0_external conduit end
set_interface_property spi_0_external EXPORT_OF spi_0.external
add_interface audio_conduit_end conduit end
set_interface_property audio_conduit_end EXPORT_OF audio.conduit_end
add_interface uart_external_connection conduit end
set_interface_property uart_external_connection EXPORT_OF uart.external_connection
add_interface pll_audio_locked conduit end
set_interface_property pll_audio_locked EXPORT_OF pll_audio.locked
add_interface memory conduit end
set_interface_property memory EXPORT_OF hps_0.memory
add_interface hps_io conduit end
set_interface_property hps_io EXPORT_OF hps_0.hps_io
add_interface hps_0_h2f_reset reset source
set_interface_property hps_0_h2f_reset EXPORT_OF hps_0.h2f_reset
add_interface alt_vip_itc_0_clocked_video conduit end
set_interface_property alt_vip_itc_0_clocked_video EXPORT_OF alt_vip_itc_0.clocked_video
add_interface ir_rx_conduit_end conduit end
set_interface_property ir_rx_conduit_end EXPORT_OF ir_rx.conduit_end

set_interconnect_requirement {$system} qsys_mm.clockCrossingAdapter HANDSHAKE
set_interconnect_requirement {$system} qsys_mm.maxAdditionalLatency 3

save_system DE1_SoC_QSYS.qsys
